# Altium project Led_Driver_Headlight.PrjPCB
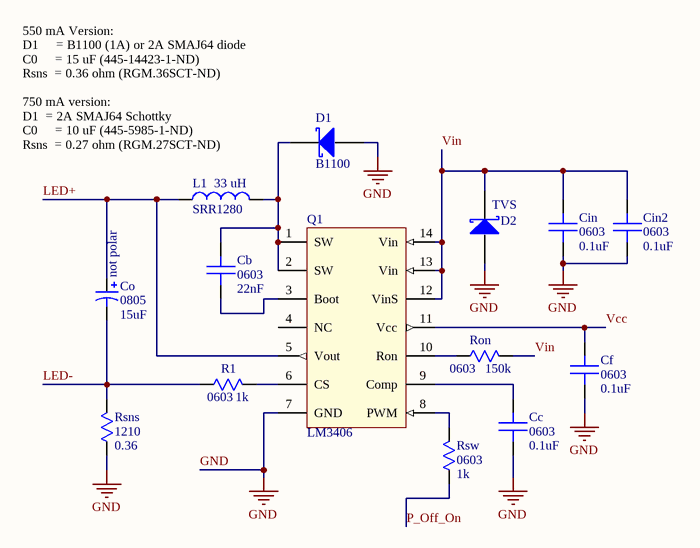
[diagram p0: Sheet1.SchDoc]
1 sheet, 14 parts. Net scope: global (net labels, ports and power ports of the same name join across sheets).
Board file: PCB1.PcbDoc

## Sheet Sheet1.SchDoc
size A

### Parts
Cb  0603  value 22nF  [0603]
Cc  0603  value 0.1uF  [0603]
Cf  0603  value 0.1uF  [0603]
Cin  0603  value 0.1uF  [0603]
Cin2  0603  value 0.1uF  [0603]
Co  0805  value 15uF  [C0805]
D1  B1100  [Diode-B1100-SMA]
D2  B1100  [Diode-B1100-SMA]  (value not drawn)
L1  SRR1280  [SRR1280-inductor]
Q1  LM3406  [TSSOP-14]
R1  0603  value 1k  [0603]
Ron  0603  value 150k  [0603]
Rsns  1210  value 0.36  [1210]
Rsw  0603  value 1k  [0603]

### Nets
GND: Cc.1 Cf.1 Cin.1 Cin2.1 D1.1(A) D2.1(A) Q1.7(GND) Rsns.1
LED+: Co.1 L1.1 Q1.5(Vout)
LED-: Co.2 R1.1 Rsns.2
P_Off_On: Rsw.1
Vcc: Cf.2 Q1.11(Vcc)
Vin: Cin.2 Cin2.2 D2.2(K) Q1.12(VinS) Q1.13(Vin) Q1.14(Vin) Ron.2
NetCb_1: Cb.1 Q1.3(Boot)
NetCb_2: Cb.2 D1.2(K) L1.2 Q1.1(SW) Q1.2(SW)
NetCc_2: Cc.2 Q1.9(Comp)
NetQ1_6: Q1.6(CS) R1.2
NetQ1_8: Q1.8(PWM) Rsw.2
NetQ1_10: Q1.10(Ron) Ron.1

Not connected (* = marked no-connect by the designer): Q1 4(NC)

### Notes on the sheet
- (near L1) 550 mA Version:
  D1     = B1100 (1A) or 2A SMAJ64 diode
  C0     = 15 uF (445-14423-1-ND)
  Rsns  = 0.36 ohm (RGM.36SCT-ND)
  750 mA version:
  D1  = 2A SMAJ64 Schottky
  C0     = 10 uF (445-5985-1-ND)
  Rsns  = 0.27 ohm (RGM.27SCT-ND)
- (near L1) 33 uH
- (near D2) TVS
- (near Co) not polar

### Library data of the parts
Cb Cc Cf Cin Cin2 = Capacitor: 0603 capacitor
Co = Cap Pol3: Polarized Capacitor (Surface Mount); Published: 8-Jun-2000; LatestRevisionDate: 29-May-2009; LatestRevisionNote: IPC-7351 Footprint Added.; PackageReference: C0805; Publisher: Altium Limited; PackageDescription: Chip Capacitor
D1 D2 = Diode - B1100
L1 = Inductor - SRR1280
Q1 = LM3406: 1.5A - LED Driver
R1 Ron Rsw = Resistor: 0603 resistor
Rsns = Resistor_1210: 1210 resistor